# Altium schematic sheet Peripherals.SchDoc
size 420 x 297 mm; Scale: 1:1; DocumentType: Схема электрическая принципиальная; SheetNumber: 12; SheetTotal: 32; DocumentTypeShort: Э3; DocumentInvertoryNumber: ㅤ
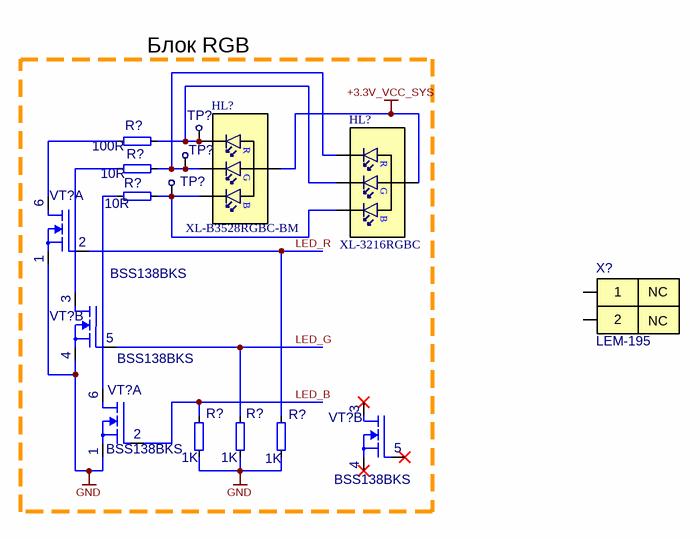
[diagram p0: Peripherals.SchDoc]

## Parts
(Parts that share a designator on the sheet are numbered #1, #2 ... from top to bottom, then left to right.)
HL?#1  XL-B3528RGBC-BM  [XL-B3528RGBC-BM]
HL?#2  XL-3216RGBC  [XL-3216RGBC]  (no BOM)
R?#1  100R  [R_0402]
R?#2  10R  [R_0402]
R?#3  10R  [R_0402]
R?#4  1K  [R_0402]
R?#5  1K  [R_0402]
R?#6  1K  [R_0402]
TP?#1  Тестовая точка  [TEST]  (value not drawn)  (no BOM)
TP?#2  Тестовая точка  [TEST]  (value not drawn)  (no BOM)
TP?#3  Тестовая точка  [TEST]  (value not drawn)  (no BOM)
VT?#1  BSS138BKS  [BSS138BKS.115]  (part A of 2)
VT?#2  BSS138BKS  [BSS138BKS.115]  (part B of 2)
VT?#3  BSS138BKS  [BSS138BKS.115]  (part A of 2)
VT?#4  BSS138BKS  [BSS138BKS.115]  (part B of 2)
X?  LEM-195  [LEM-195]

## Blocks framed on the sheet
Блок RGB: HL?#1 HL?#2 R?#1-R?#6 TP?#1-TP?#3 VT?#1-VT?#4

## Nets
+3.3V_VCC_SYS: HL?#1.2 HL?#2.3
GND: R?#4.1 R?#5.1 R?#6.1 VT?#1.1(S1) VT?#2.4(S2) VT?#3.1(S1)
LED_B: R?#4.2 VT?#3.2(G1)
LED_G: R?#5.2 VT?#2.5(G2)
LED_R: R?#6.2 VT?#1.2(G1)
NetHL?#1_1: HL?#1.1 HL?#2.4 R?#1.2 TP?#1.1
NetHL?#1_3: HL?#1.3 HL?#2.2 R?#2.2 TP?#2.1
NetHL?#1_4: HL?#1.4 HL?#2.1 R?#3.2 TP?#3.1
NetR?#1_1: R?#1.1 VT?#1.6(D1)
NetR?#2_1: R?#2.1 VT?#2.3(D2)
NetR?#3_1: R?#3.1 VT?#3.6(D1)

Not connected (* = marked no-connect by the designer): VT?#4 3(D2)* 4(S2)* 5(G2)*; X? 1 2

## Notes on the sheet
- Подп. и дата
- Инв. № дубл.
- Взам. инв. №
- Инв. № подл.
- Изм.
- Лист
- № докум.
- Подп.
- Дата
- Копировал
- Формат А3
- (in symbol LEM-195) NC
- (in symbol XL-3216RGBC) R; G; B
- (in symbol XL-B3528RGBC-BM) R; G; B

## Library data of the parts
HL?#1 = XL-B3528RGBC-BM: 20mA 无色透明透镜 -40℃~+85℃ Common anode 正贴 RGB 45mW SMD2835-4P Light Emitting Diodes (LED) ROHS; Manufacturer: XINGLIGHT; Check: False; Part Number: XL-B3528RGBC-BM; NameFromManufacturer: XL-B3528RGBC-BM; Value: XL-B3528RGBC-BM
HL?#2 = XL-3216RGBC: 25mA -30℃~+85℃ 正贴 RGB 120° 1206 Light Emitting Diodes (LED) ROHS; Manufacturer: XINGLIGHT; Check: False; Part Number: XL-3216RGBC; NameFromManufacturer: XL-3216RGBC; Value: XL-3216RGBC
R?#1 = 0402-0.0625W-100R-100ppm±1%: NameFromManufacturer: RC0402FR-07100RL; Manufacturer: Yageo; Place: S; Tolerance: 1%; Check: False; Part Number: 0402-0.0625W-100R-100ppm±1%; Value: 100R; Temperature: -55°C~155°C; ComponentLink1Description: DATASHEET; ComponentLink1URL: https://www.yageo.com/upload/media/product/productsearch/datasheet/rchip/PYu-RC_Group_51_RoHS_L_11.pdf; Datasheet: Datasheets/resistors/PYu-RC_Group_51_RoHS_L_11.pdf; Last changed: 27.10.2022
R?#2 R?#3 = 0402-0.0625W-10R-200ppm±1%: NameFromManufacturer: RC0402FR-0710RL; Manufacturer: Yageo; Place: S; Tolerance: 1%; Check: False; Part Number: 0402-0.0625W-10R-200ppm±1%; Value: 10R; Temperature: -55°C~155°C; ComponentLink1Description: DATASHEET; ComponentLink1URL: https://www.compel.ru/infosheet/YAG/RC0402FR-0710RL; Datasheet: Datasheets/resistors/PYu-RC_Group_51_RoHS_L_11.pdf; Last changed: 27.10.2022
R?#4-R?#6 = 0402-0.0625W-1K-100ppm±5%: NameFromManufacturer: RC0402JR-071KL; Manufacturer: Yageo; Place: S; Tolerance: 5%; Check: False; Annotation: *; Param: *; Value: 1K; Part Number: 0402-0.0625W-1K-100ppm±5%; Temperature: -55°C~155°C; ComponentLink1Description: DATASHEET; ComponentLink1URL: https://ru.mouser.com/ProductDetail/YAGEO/RC0402JR-071KL?qs=%2Fha2pyFadugNN0LzwXn2qBG%2Fxv0pCy6gh7Z%252B1hZJT2CnjLeHVORGDQ%3D%3D; Datasheet: #https://www.yageo.com/upload/media/product/productsearch/datasheet/rchip/PYu-RC_Group_51_RoHS_L_11.pdf#; Last changed: 12.10.2021
TP?#1-TP?#3 = Тестовая точка: *; Check: False; Part Number: Тестовая точка; Value: Тестовая точка; ComponentLink1Description: DATASHEET; Manufacturer: *
VT?#1-VT?#4 = BSS138BKS.115: Transistor MOSFET Array Dual N-CH 60V 320mA 6-Pin TSSOP T/R; Manufacturer: ElecSuper; Check: False; Part Number: BSS138BKS; Value: BSS138BKS; NameFromManufacturer: BSS138BKS
X? = LEM-195: Manufacturer: Kang Yang; Check: False; Part Number: LEM-195; Value: LEM-195; NameFromManufacturer: LEM-195